# EAGLE design p1 (EAGLE 9.6.2)
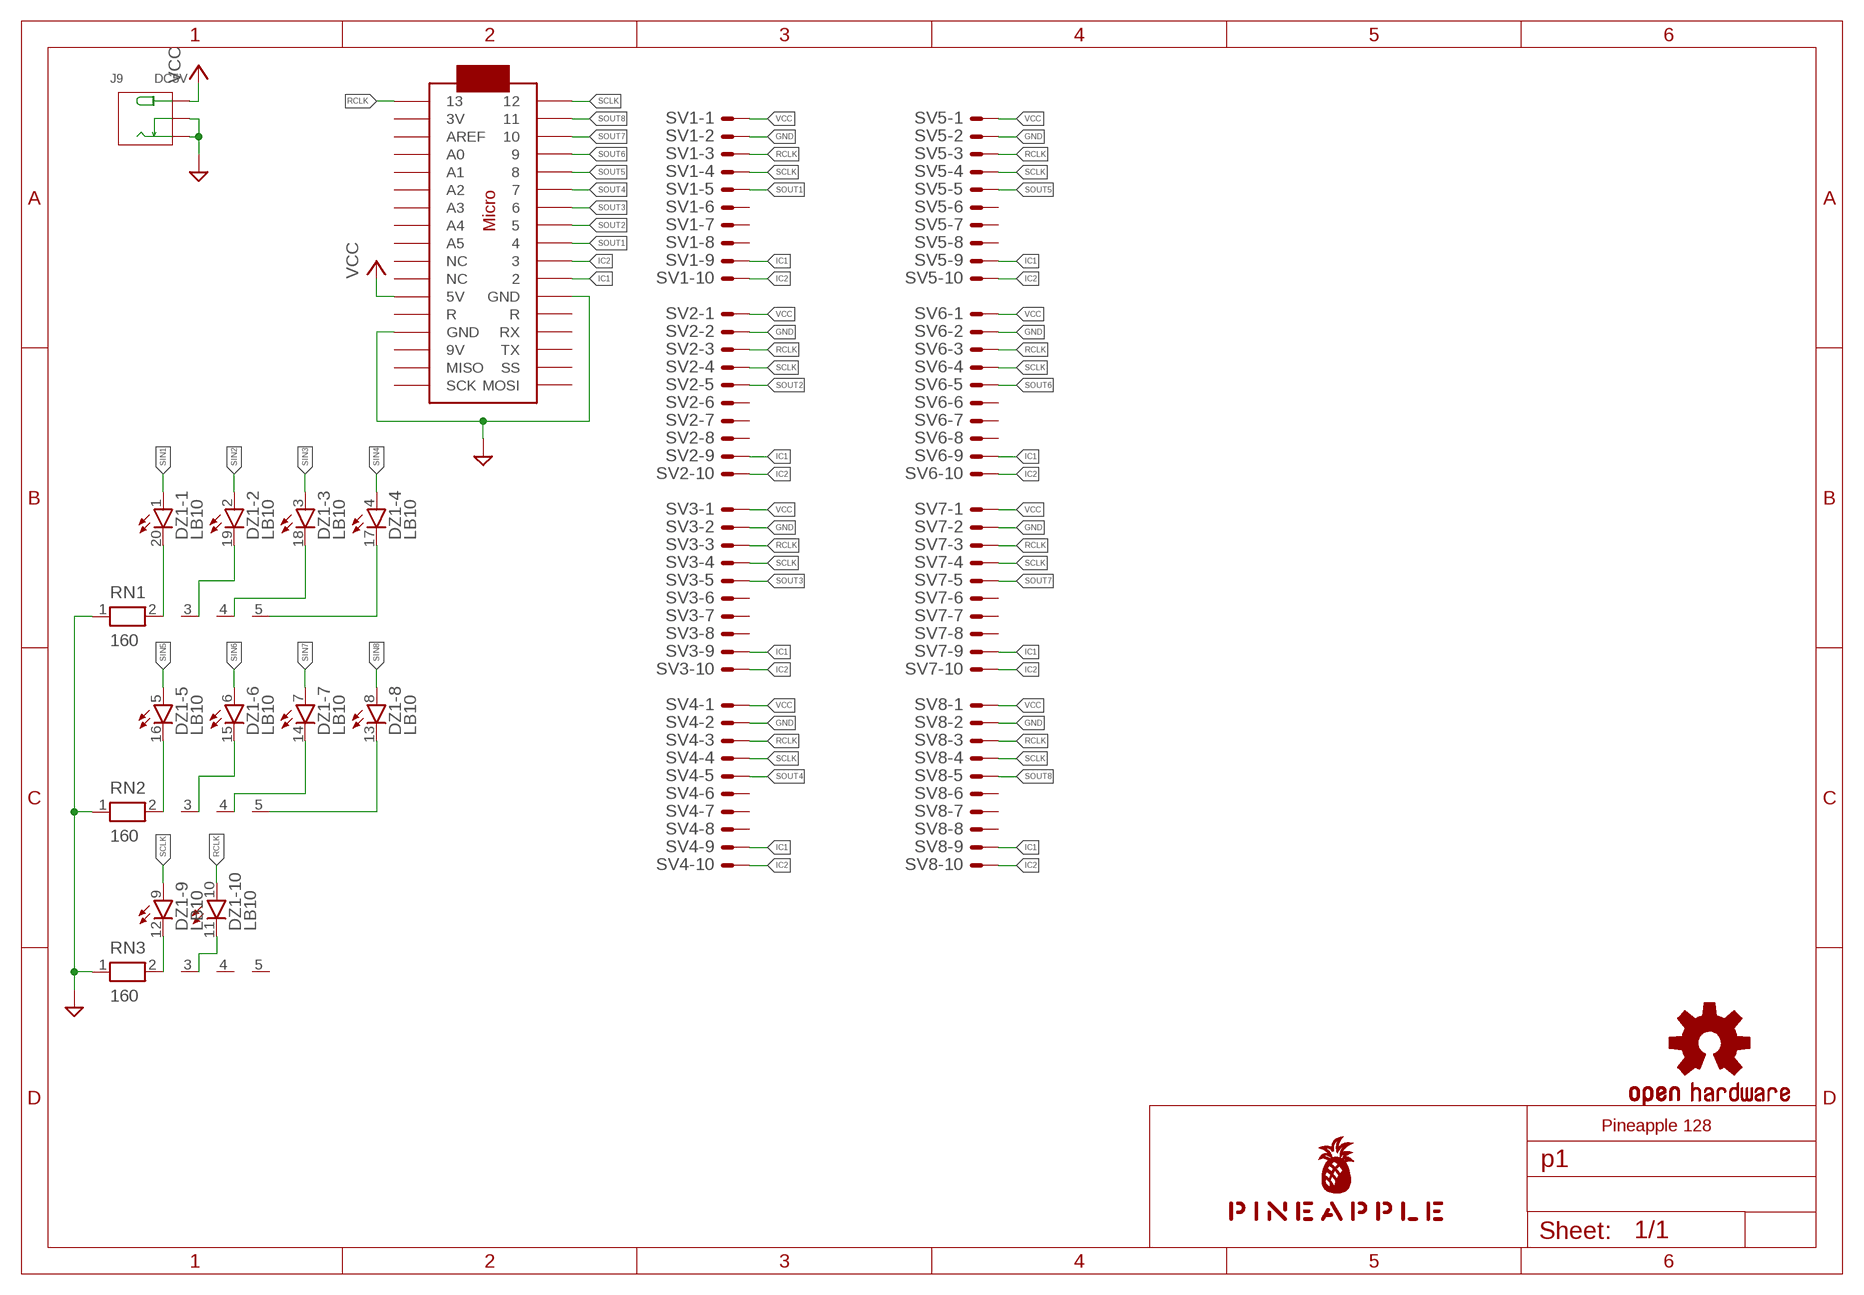
[diagram p0: schematic, sheet 1]

## Parts
DZ1  LB10  [LB10]
J9  DC5V  JACK-DC-005'DC-005'  [3P-L14.2*W11.0*H9.0MM]
LOGO1  OSHW-LOGOS-COPPER  [OSHW-LOGO-S_COPPER]
RN1  160  RN04  [RN-5]
RN2  160  RN04  [RN-5]
RN3  160  RN04  [RN-5]
SV1  ML10E  [ML10]
SV2  ML10E  [ML10]
SV3  ML10E  [ML10]
SV4  ML10E  [ML10]
SV5  ML10E  [ML10]
SV6  ML10E  [ML10]
SV7  ML10E  [ML10]
SV8  ML10E  [ML10]
U$1  PINEAPPLE450_SILK  [PINEAPPLE450_SILK]
U$2  ARDUINOMICRO  [ARDUINOMICRO]

## Nets
GND [gnd]: J9.-1(-) J9.-2(CDN) RN1.1 RN2.1 RN3.1 SV1.2 SV2.2 SV3.2 SV4.2 SV5.2 SV6.2 SV7.2 SV8.2 U$2.P$12(GND) U$2.P$21(GND)
IC1: SV1.9 SV2.9 SV3.9 SV4.9 SV5.9 SV6.9 SV7.9 SV8.9 U$2.P$11
IC2: SV1.10 SV2.10 SV3.10 SV4.10 SV5.10 SV6.10 SV7.10 SV8.10 U$2.P$10
N$1: DZ1.20(-1:C) RN1.2
N$2: DZ1.19(-2:C) RN1.3
N$3: DZ1.18(-3:C) RN1.4
N$4: DZ1.17(-4:C) RN1.5
N$5: DZ1.16(-5:C) RN2.2
N$6: DZ1.15(-6:C) RN2.3
N$7: DZ1.14(-7:C) RN2.4
N$8: DZ1.13(-8:C) RN2.5
N$9: DZ1.12(-9:C) RN3.2
N$10: DZ1.11(-10:C) RN3.3
RCLK: DZ1.10(-10:A) SV1.3 SV2.3 SV3.3 SV4.3 SV5.3 SV6.3 SV7.3 SV8.3 U$2.P$34
SCLK: DZ1.9(-9:A) SV1.4 SV2.4 SV3.4 SV4.4 SV5.4 SV6.4 SV7.4 SV8.4 U$2.P$1
SIN1: DZ1.1(-1:A)
SIN2: DZ1.2(-2:A)
SIN3: DZ1.3(-3:A)
SIN4: DZ1.4(-4:A)
SIN5: DZ1.5(-5:A)
SIN6: DZ1.6(-6:A)
SIN7: DZ1.7(-7:A)
SIN8: DZ1.8(-8:A)
SOUT1: SV1.5 U$2.P$9
SOUT2: SV2.5 U$2.P$8
SOUT3: SV3.5 U$2.P$7
SOUT4: SV4.5 U$2.P$6
SOUT5: SV5.5 U$2.P$5
SOUT6: SV6.5 U$2.P$4
SOUT7: SV7.5 U$2.P$3
SOUT8: SV8.5 U$2.P$2
VCC [power]: J9.+ SV1.1 SV2.1 SV3.1 SV4.1 SV5.1 SV6.1 SV7.1 SV8.1 U$2.P$23(5V)
Unconnected: RN3.4 RN3.5 SV1.6 SV1.7 SV1.8 SV2.6 SV2.7 SV2.8 SV3.6 SV3.7 SV3.8 SV4.6 SV4.7 SV4.8 SV5.6 SV5.7 SV5.8 SV6.6 SV6.7 SV6.8 SV7.6 SV7.7 SV7.8 SV8.6 SV8.7 SV8.8 U$2.P$13(R) U$2.P$14(RX) U$2.P$15(TX) U$2.P$16(SS) U$2.P$17(MOSI) U$2.P$18(SCK) U$2.P$19(MISO) U$2.P$20(9V) U$2.P$22(R) U$2.P$24(NC) U$2.P$25(NC) U$2.P$26(A5) U$2.P$27(A4) U$2.P$28(A3) U$2.P$29(A2) U$2.P$30(A1) U$2.P$31(A0) U$2.P$32(AREF) U$2.P$33(3V)

## Notes on the sheet
- Pineapple 128

## Library data of the parts
DZ1 = led:LB10: LED BLOCK 10-LED bar graph, DIL, Siemens
J9 = Seeed-Connector:JACK-DC-005: 320120003
LOGO1 = SparkFun-Aesthetics:OSHW-LOGO: Open-Source Hardware (OSHW) Logo This logo indicates the piece of hardware it is found on incorporates a OSHW license and/or adheres to the definition of open source hardware found here: http://freedomdefined.org/OSHW
RN1-RN3 = resistor-net:RN04: RESISTOR NETWORK; OC_FARNELL: unknown; OC_NEWARK: unknown
SV1-SV8 = con-ml:ML10E: HARTING; OC_FARNELL: unknown; OC_NEWARK: unknown
U$1 = pineapple:PINEAPPLE450_SILK
U$2 = adafruit:ARDUINOMICRO

## Net classes
0 default: width 0.152 mm, drill 0.152 mm, clearance 0.152 mm
1 gnd: width 0.305 mm, drill 0.152 mm, clearance 0.152 mm
2 power: width 0.305 mm, drill 0.152 mm, clearance 0.152 mm
3 analog: width 0.152 mm, drill 0.152 mm, clearance 0.152 mm

## Board
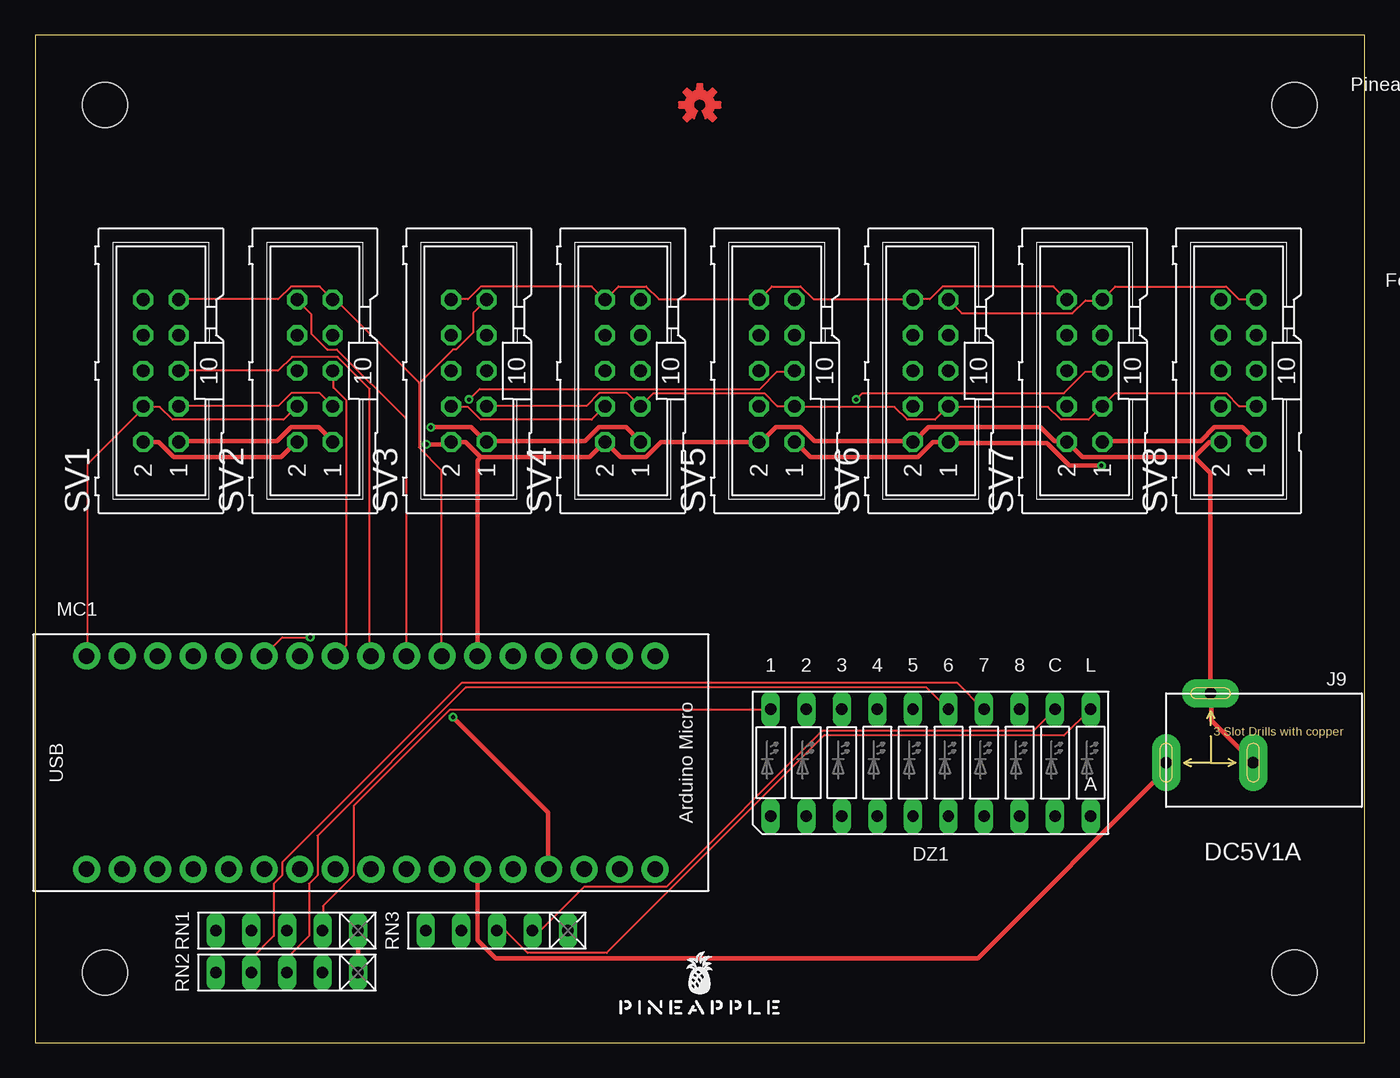
[diagram p1: board, top side]
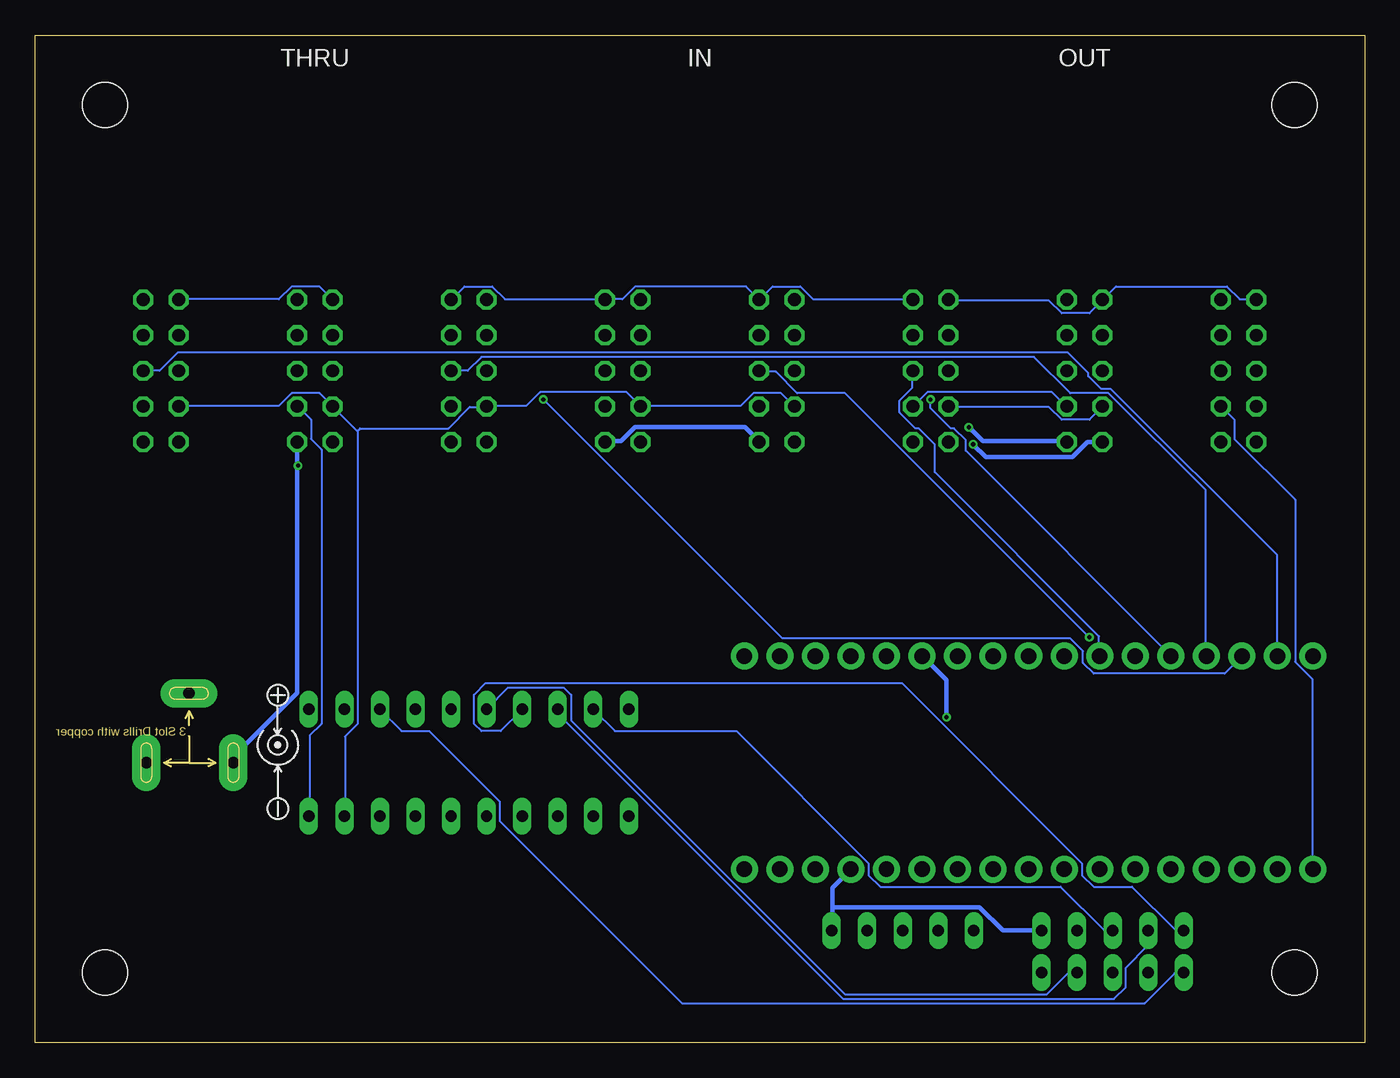
[diagram p2: board, bottom side, seen from below]

Size 95 x 72 mm. Coordinates in mm from the lower left corner, seen from the top.
Outline: 0,0 95,0 95,72 0,72 0,0
Copper layers (1*16): Top 0.035mm / dielectric 1.5mm / Bottom 0.035mm
Design rules "SeeedStudio_2layer_DRU_no_angle_20140221": minimum track width 6mil, minimum drill 12mil, track to track 6mil, track to pad 6mil, pad to pad 6mil, via to via 6mil, smd to smd 0mil, copper to edge 10mil, drill to drill 10mil, minimum pad ring 10mil, minimum via ring 6mil, stop-mask expansion 2mil, vias tented up to drill 100mil, thermal gap 10mil
Holes 3.2 mm at 5,5 90,5 90,67 5,67
tRestrict: area 2.8,64.8 to 7.2,69.2; area 87.8,64.8 to 92.2,69.2; area 2.8,2.8 to 7.2,7.2; area 87.8,2.8 to 92.2,7.2; area 0,71 to 95,72; area 94,0 to 95,72; area 0,0 to 95,1; area 0,0 to 1,72
bRestrict: area 2.8,2.8 to 7.2,7.2; area 87.8,2.8 to 92.2,7.2; area 87.8,64.8 to 92.2,69.2; area 2.8,64.8 to 7.2,69.2; area 0,71 to 95,72; area 94,0 to 95,72; area 0,0 to 95,1; area 0,0 to 1,72

### Footprints (pad centres in the part's own frame; a part is rotated, then mirrored left to right if it is on the bottom)
LB10 = drill 0.813 long: 1 -11.43,-3.81; 2 -8.89,-3.81; 3 -6.35,-3.81; 4 -3.81,-3.81; 5 -1.27,-3.81; 6 1.27,-3.81; 7 3.81,-3.81; 8 6.35,-3.81; 9 8.89,-3.81; 10 11.43,-3.81; 11 11.43,3.81; 12 8.89,3.81; 13 6.35,3.81; 14 3.81,3.81; 15 1.27,3.81; 16 -1.27,3.81; 17 -3.81,3.81; 18 -6.35,3.81; 19 -8.89,3.81; 20 -11.43,3.81
3P-L14.2*W11.0*H9.0MM = drill 0.813 pad 2.032 long: + 3.175,0; -1 -3.048,0; -2 0,-4.953
RN-5 = drill 0.813 long: 1 -5.08,0; 2 -2.54,0; 3 0,0; 4 2.54,0; 5 5.08,0
ML10 = drill 0.914 octagon: 1 -5.08,-1.27; 2 -5.08,1.27; 3 -2.54,-1.27; 4 -2.54,1.27; 5 0,-1.27; 6 0,1.27; 7 2.54,-1.27; 8 2.54,1.27; 9 5.08,-1.27; 10 5.08,1.27
ARDUINOMICRO = drill 1.1 pad 1.93: P$1 -20.32,7.62; P$2 -17.78,7.62; P$3 -15.24,7.62; P$4 -12.7,7.62; P$5 -10.16,7.62; P$6 -7.62,7.62; P$7 -5.08,7.62; P$8 -2.54,7.62; P$9 0,7.62; P$10 2.54,7.62; P$11 5.08,7.62; P$12 12.7,-7.62; P$13 10.16,-7.62; P$14 12.7,7.62; P$15 15.24,7.62; P$16 17.78,7.62; P$17 20.32,7.62; P$18 20.32,-7.62; P$19 17.78,-7.62; P$20 15.24,-7.62; P$21 7.62,7.62; P$22 10.16,7.62; P$23 7.62,-7.62; P$24 5.08,-7.62; P$25 2.54,-7.62; P$26 0,-7.62; P$27 -2.54,-7.62; P$28 -5.08,-7.62; P$29 -7.62,-7.62; P$30 -10.16,-7.62; P$31 -12.7,-7.62; P$32 -15.24,-7.62; P$33 -17.78,-7.62; P$34 -20.32,-7.62

### Placement (x,y rotation side)
DZ1  64,20 0 top
J9  84,20 180 top
LOGO1  47.5,67 0 top
RN1  18,8 180 top
RN2  18,5 180 top
RN3  33,8 180 top
SV1  9,48 90 top
SV2  20,48 90 top
SV3  31,48 90 top
SV4  42,48 90 top
SV5  53,48 90 top
SV6  64,48 90 top
SV7  75,48 90 top
SV8  86,48 90 top
U$1  47.5,2 0 top
U$2  24,20 0 top

### Tracks (layer width: path | path; a pad name or v marks a point on that pad's centre or on a via)
GND  (via drill 0.3)
  Top 0.305: RN2.1 23.09,5.03 23.09,7.92 RN1.1 | J9.-1 87.02,20.04 84.05,23.01 84.05,24.92 J9.-2 83.97,25.07 83.97,40.69 82.83,41.83 | SV1.2 7.77,42.9 8.84,42.9 9.91,41.83 17.6,41.83 18.67,42.9 SV2.2 | 31.85,41.83 30.79,42.9 29.79,42.9 SV3.2 29.64,42.82 29.57,42.75 v27.96,42.75 | 31.85,41.83 39.62,41.83 40.69,42.9 SV4.2 40.84,42.82 41.83,41.83 43.66,41.83 44.73,42.9 51.66,42.9 SV5.2 51.89,42.9 52.96,43.97 54.71,43.97 55.7,42.98 62.71,42.98 SV6.2 62.87,42.98 63.86,43.97 71.86,43.97 72.85,42.98 73.69,42.98 SV7.2 73.84,42.82 74.83,41.83 82.83,41.83 | 82.83,41.83 83.9,42.9 84.66,42.9 SV8.2 | 31.85,41.83 31.62,41.6 31.62,27.66 U$2.P$21 | v29.87,23.24 36.65,16.46 36.65,12.42 U$2.P$12
  Bottom 0.305: 38.02,9.68 38.02,11.05 36.73,12.34 U$2.P$12 | 38.02,9.68 38.02,8 RN3.1 | 38.02,9.68 27.51,9.68 25.83,8 RN1.1 | v27.96,42.75 27.05,41.83 20.88,41.83 19.81,42.9 18.75,42.9 SV2.2 | v29.87,23.24 29.87,25.91 31.55,27.58 U$2.P$21
IC1
  Top 0.152: SV6.9 65.3,53.03 66.22,52.12 74.14,52.12 75.06,53.03 76.2,53.03 SV7.9 76.28,53.11 77.19,54.03 85.11,54.03 86.03,53.11 87.25,53.11 SV8.9 | SV1.9 10.29,53.11 17.37,53.11 18.29,54.03 20.34,54.03 21.26,53.11 SV2.9 21.34,53.03 21.57,53.03 27.47,47.13 | 27.47,47.13 29.87,49.53 30.1,49.53 31.32,50.75 31.32,52.12 32.23,53.03 SV3.9 | 27.47,47.13 27.43,47.09 27.43,42.52 29.03,40.92 29.03,27.66 U$2.P$11
  Bottom 0.152: SV6.9 65.23,53.11 64.31,54.03 62.33,54.03 61.42,53.11 54.33,53.11 SV5.9 54.25,53.11 53.03,53.11 52.12,54.03 44.2,54.03 43.28,53.11 SV4.9 43.2,53.11 42.29,54.03 40.31,54.03 39.4,53.11 32.31,53.11 SV3.9
IC2
  Top 0.152: SV7.10 73.69,53.11 72.77,54.03 64.85,54.03 63.93,53.11 62.79,53.11 SV6.10 62.71,53.11 55.63,53.11 54.71,54.03 52.65,54.03 51.74,53.11 SV5.10 51.66,53.11 44.58,53.11 43.66,54.03 41.68,54.03 40.77,53.11 SV4.10 40.69,53.11 39.78,54.03 31.85,54.03 30.94,53.11 29.79,53.11 SV3.10 | U$2.P$10 26.52,27.66 26.52,44.58 21.57,49.53 20.88,49.53 19.74,50.67 19.74,52.05 18.75,53.03 SV2.10
  Bottom 0.152: SV8.10 84.66,53.11 77.57,53.11 76.66,54.03 74.68,54.03 73.76,53.11 SV7.10 | SV1.10 7.77,53.11 8.91,53.11 9.83,54.03 17.75,54.03 18.67,53.11 SV2.10 18.75,53.03 19.66,52.12 21.64,52.12 22.55,53.03 29.72,53.03 SV3.10
N$1
  Top 0.152: RN1.2 20.57,8 20.57,9.75 22.78,11.96 22.78,16.92 29.64,23.77 52.5,23.77 DZ1.20
N$2
  Bottom 0.152: RN1.3 18.06,8 18.59,8 21.72,11.12 34.59,11.12 35.43,11.96 35.43,12.8 44.88,22.25 53.57,22.25 55.09,23.77 DZ1.19
N$3
  Bottom 0.152: RN1.4 15.47,7.92 15.47,6.93 17.07,5.33 17.07,3.96 17.91,3.12 37.26,3.12 57.61,23.47 57.61,23.77 DZ1.18
N$4
  Bottom 0.152: RN1.5 12.95,8 13.49,8 16.61,11.12 19.36,11.12 20.19,11.96 20.19,12.8 33.07,25.68 62.79,25.68 63.63,24.84 63.63,22.78 63.09,22.25 61.72,22.25 60.2,23.77 DZ1.17
N$5
  Bottom 0.152: RN2.2 20.57,4.95 21.18,4.95 22.71,3.43 37.11,3.43 56.69,23.01 56.69,24.84 57.23,25.38 61.19,25.38 62.71,23.85 DZ1.16
N$6
  Top 0.152: RN2.3 18.06,5.03 18.06,6.1 19.58,7.62 19.58,11.35 20.19,11.96 20.19,14.78 30.79,25.38 63.7,25.38 65.23,23.85 DZ1.15
N$7
  Top 0.152: RN2.4 15.47,5.03 15.47,6.02 17.07,7.62 17.07,11.35 17.68,11.96 17.68,12.88 30.48,25.68 65.91,25.68 67.74,23.85 DZ1.14
N$8
  Bottom 0.152: RN2.5 12.95,4.95 13.56,4.95 15.7,2.82 48.77,2.82 61.8,15.85 61.8,17.22 66.83,22.25 68.81,22.25 70.33,23.77 DZ1.13
N$9
  Top 0.152: RN3.2 35.59,8 36.12,8 39.24,11.12 45.11,11.12 56.24,22.25 71.32,22.25 72.85,23.77 DZ1.12
N$10
  Top 0.152: RN3.3 33.07,7.92 33.68,7.92 35.2,6.4 40.84,6.4 56.39,21.95 73.53,21.95 75.36,23.77 DZ1.11
RCLK
  Top 0.152: SV8.3 87.25,45.49 86.03,45.49 85.11,46.41 77.19,46.41 76.28,45.49 SV7.3 76.2,45.41 75.29,44.5 73.3,44.5 72.39,45.41 65.3,45.41 SV6.3 65.23,45.41 64.31,44.5 62.33,44.5 61.42,45.41 54.33,45.41 SV5.3 54.25,45.49 53.03,45.49 52.12,46.41 44.2,46.41 43.28,45.49 SV4.3 43.2,45.49 42.29,46.41 40.31,46.41 39.4,45.49 32.31,45.49 SV3.3 | SV1.3 10.29,45.49 17.37,45.49 18.29,46.41 20.34,46.41 21.26,45.49 SV2.3
  Bottom 0.152: DZ1.10 75.36,16.23 75.36,21.95 74.52,22.78 74.52,42.37 75.29,43.13 75.29,44.5 76.2,45.41 SV7.3 | U$2.P$34 3.73,12.42 3.73,25.98 4.95,27.2 4.95,38.79 9.3,43.13 9.3,44.5 10.21,45.41 SV1.3 | SV3.3 32.23,45.49 31.24,46.48 22.33,46.48 21.34,45.49 SV2.3
SCLK
  Top 0.152: SV3.4 29.79,45.41 30.94,45.41 31.85,44.5 39.78,44.5 40.69,45.41 SV4.4 | SV2.4 18.67,45.41 17.75,44.5 9.83,44.5 8.91,45.41 7.77,45.41 SV1.4 7.77,45.34 3.73,41.3 3.73,27.66 U$2.P$1
  Bottom 0.152: 71.97,43.7 73.69,45.41 SV7.4 73.76,45.49 74.68,46.41 76.66,46.41 77.57,45.49 84.66,45.49 SV8.4 | 71.97,43.7 71.93,43.66 71.93,22.78 72.85,21.87 72.85,16.23 DZ1.9 | 71.97,43.7 71.78,43.89 65.46,43.89 63.93,45.41 62.79,45.41 SV6.4 62.71,45.49 59.89,45.49 58.9,46.48 52.73,46.48 51.74,45.49 SV5.4 51.66,45.49 44.58,45.49 43.66,46.41 41.68,46.41 40.77,45.49 SV4.4 | SV3.4 29.72,45.41 22.55,45.41 21.64,44.5 19.66,44.5 18.75,45.41 SV2.4
SOUT1
  Top 0.152: SV1.5 10.29,48.01 17.37,48.01 18.36,49 21.64,49 23.93,46.71 23.93,27.66 U$2.P$9
SOUT2
  Top 0.152: SV2.5 21.34,47.93 21.34,46.79 22.25,45.87 22.25,28.42 21.49,27.66 U$2.P$8
SOUT3
  Bottom 0.152: SV3.5 32.31,47.93 32.31,46.79 33.22,45.87 33.22,45.03 32.08,43.89 31.85,43.89 30.71,42.75 30.71,40.77 18.97,29.03 18.97,27.66 U$2.P$7
SOUT4  (via drill 0.3)
  Top 0.152: v19.66,28.96 17.68,28.96 16.38,27.66 U$2.P$6
  Bottom 0.152: v19.66,28.96 37.11,46.41 40.54,46.41 42.06,47.93 43.2,47.93 SV4.5
SOUT5  (via drill 0.3)
  Top 0.152: v31.01,45.95 31.77,46.71 51.82,46.71 53.03,47.93 54.25,47.93 SV5.5
  Bottom 0.152: v31.01,45.95 31.01,45.34 29.57,43.89 29.34,43.89 28.5,43.05 28.5,42.29 13.87,27.66 U$2.P$5
SOUT6
  Bottom 0.152: SV6.5 65.23,48.01 64.08,48.01 63.09,49 23.62,49 21.03,46.41 18.29,46.41 11.35,39.47 11.35,27.66 U$2.P$4
SOUT7  (via drill 0.3)
  Top 0.152: v58.67,45.95 59.13,46.41 73.53,46.41 75.06,47.93 76.2,47.93 SV7.5
  Bottom 0.152: v58.67,45.95 41.6,28.88 21.03,28.88 20.12,27.96 20.12,27.13 19.36,26.36 9.98,26.36 8.76,27.58 U$2.P$3
SOUT8
  Bottom 0.152: SV8.5 87.25,48.01 86.11,48.01 84.81,49.3 21.18,49.3 19.74,47.85 19.74,47.62 18.82,46.71 18.14,46.71 6.25,34.82 6.25,27.66 U$2.P$2
VCC  (via drill 0.3)
  Top 0.305: SV1.1 10.29,42.98 17.3,42.98 18.29,43.97 20.27,43.97 21.26,42.98 SV2.1 | SV4.1 43.2,42.98 42.22,43.97 40.31,43.97 39.32,42.98 32.31,42.98 SV3.1 32.16,42.98 31.17,43.97 v28.27,43.97 | SV5.1 54.33,42.9 55.4,41.83 63.09,41.83 64.16,42.9 65.23,42.9 SV6.1 65.38,42.82 72.31,42.82 73.91,41.22 v76.2,41.22 | SV7.1 76.28,42.98 83.29,42.98 84.28,43.97 86.26,43.97 87.25,42.98 SV8.1 | U$2.P$23 31.62,12.34 31.62,7.32 32.92,6.02 67.36,6.02 80.77,19.43 80.77,19.96 J9.+
  Bottom 0.305: SV5.1 54.25,42.98 53.11,42.98 52.12,43.97 44.27,43.97 43.28,42.98 SV4.1 | v28.27,43.97 27.28,42.98 21.34,42.98 SV2.1 | 76.28,41.22 76.28,24.99 80.77,20.5 80.77,20.04 J9.+ | 76.28,41.22 76.28,42.9 SV7.1 | v76.2,41.22 76.28,41.22

### Text on the board
tNames: Pineapple 128 1.0.0-X | For Necobit DT-8 R3 | MC1 | 1 | 2 | 3 | 4 | 5 | 6 | 7 | 8 | C | L | USB | Arduino Micro | A | GND | DC5V1A
bNames: OUT | IN | THRU